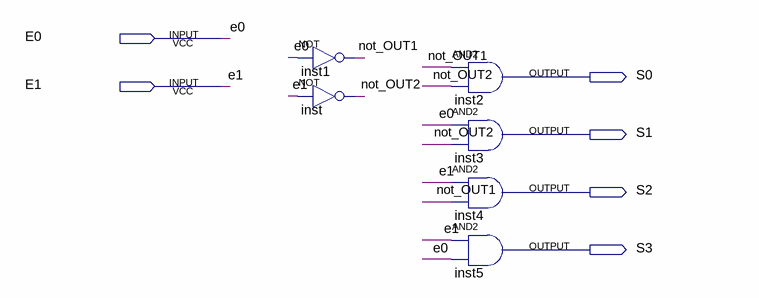
[diagram p0: schematic sheet]
// Quartus schematic DECODER_2X4_SEM_ENABLE.bdf as structural Verilog: 6 symbols, 6 pins
module DECODER_2X4_SEM_ENABLE (
  input  E0,
  input  E1,
  output S0,
  output S1,
  output S2,
  output S3
);

  wire not_OUT1, not_OUT2;

  not inst1 (not_OUT1, E0);
  not inst (not_OUT2, E1);
  and inst2 (S0, not_OUT1, not_OUT2);
  and inst3 (S1, E0, not_OUT2);
  and inst4 (S2, E1, not_OUT1);
  and inst5 (S3, E1, E0);
endmodule
